# EAGLE design SC16IS750_Breakout (EAGLE 6.4)
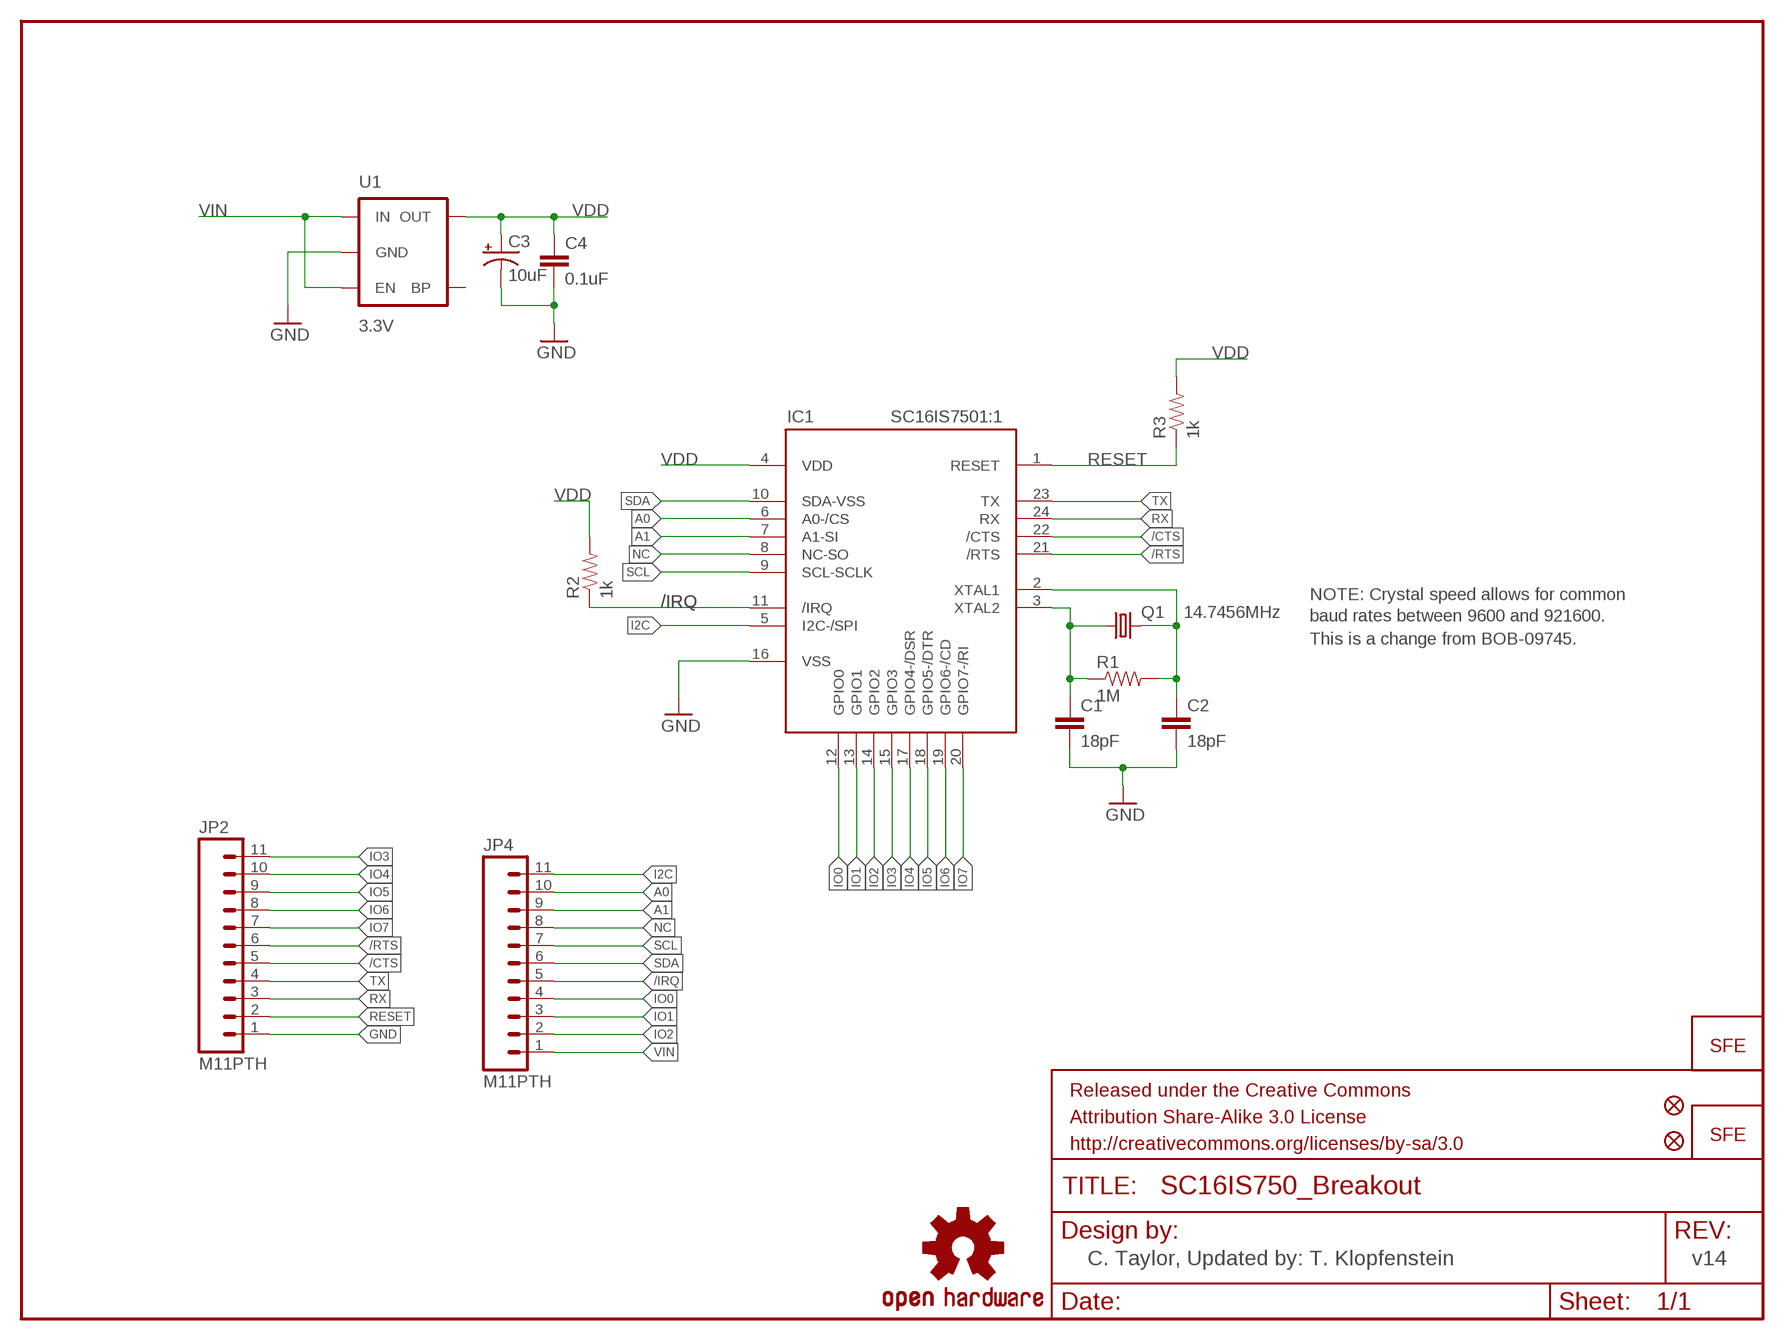
[diagram p0: schematic, sheet 1]

## Parts
C1  18pF  CAP0603-CAP  [0603-CAP]
C2  18pF  CAP0603-CAP  [0603-CAP]
C3  10uF  CAP_POL1206  [EIA3216]
C4  0.1uF  CAP0603-CAP  [0603-CAP]
IC1  SC16IS7501:1  [QFN-24_1:1]
JP1  LOGO-SFENEW  [SFE-NEW-WEBLOGO]
JP2  M11PTH  [1X11]
JP3  LOGO-SFESK  [SFE-LOGO-FLAME]
JP4  M11PTH  [1X11]
JP5  FIDUCIAL1X2  [FIDUCIAL-1X2]
JP6  FIDUCIAL1X2  [FIDUCIAL-1X2]
Q1  14.7456MHz  CRYSTAL5X3  [CRYSTAL-SMD-5X3]
R1  1M  RESISTOR0603-RES  [0603-RES]
R2  1k  RESISTOR0603-RES  [0603-RES]
R3  1k  RESISTOR0603-RES  [0603-RES]
U1  3.3V  V_REG_LDOSMD  [SOT23-5]
U$1  OSHW-LOGOS  [OSHW-LOGO-S]

## Nets
/CTS: IC1.22(/CTS) JP2.5
/IRQ: IC1.11(/IRQ) JP4.5 R2.1
/RTS: IC1.21(/RTS) JP2.6
A0: IC1.6(A0-/CS) JP4.10
A1: IC1.7(A1-SI) JP4.9
GND: C1.2 C2.2 C3.C(-) C4.2 IC1.16(VSS) JP2.1 U1.2(GND)
I2C: IC1.5(I2C-/SPI) JP4.11
IO0: IC1.12(GPIO0) JP4.4
IO1: IC1.13(GPIO1) JP4.3
IO2: IC1.14(GPIO2) JP4.2
IO3: IC1.15(GPIO3) JP2.11
IO4: IC1.17(GPIO4-/DSR) JP2.10
IO5: IC1.18(GPIO5-/DTR) JP2.9
IO6: IC1.19(GPIO6-/CD) JP2.8
IO7: IC1.20(GPIO7-/RI) JP2.7
N$23: C1.1 IC1.3(XTAL2) Q1.1 R1.1
N$24: C2.1 IC1.2(XTAL1) Q1.3 R1.2
NC: IC1.8(NC-SO) JP4.8
RESET: IC1.1(RESET) JP2.2 R3.1
RX: IC1.24(RX) JP2.3
SCL: IC1.9(SCL-SCLK) JP4.7
SDA: IC1.10(SDA-VSS) JP4.6
TX: IC1.23(TX) JP2.4
VDD: C3.A(+) C4.1 IC1.4(VDD) R2.2 R3.2 U1.5(OUT)
VIN: JP4.1 U1.1(IN) U1.3(EN)
Unconnected: U1.4(BP)

## Notes on the sheet
- NOTE: Crystal speed allows for common
- baud rates between 9600 and 921600.
- This is a change from BOB-09745.
- C. Taylor, Updated by: T. Klopfenstein | v14

## Library data of the parts
C1 C2 C4 = SparkFun-Passives:CAP: Capacitor Standard 0603 ceramic capacitor, and 0.1" leaded capacitor.
C3 = SparkFun:CAP_POL: Capacitor Polarized These are standard SMD and PTH capacitors. Normally 10uF, 47uF, and 100uF in electrolytic and tantalum varieties. Always verify the external diameter of the through hole cap, it varies with capacity, voltage, and manufacturer. The EIA devices should be standard.
IC1 = Testing:SC16IS750
JP1 JP3 = SparkFun:LOGO-SFE: Spark Fun Electronics PCB Logo This is the standard Spark Fun Electronics PCB logo.
JP2 JP4 = SparkFun:M11: Header 11 Standard 11-pin 0.1" header. Use with straight break away headers (SKU : PRT-00116), right angle break away headers (PRT-00553), swiss pins (PRT-00743), machine pins (PRT-00117), and female headers (PRT-00115).
JP5 JP6 = SparkFun:FIDUCIAL: Fiducial Alignment Points Various fiducial points for machine vision alignment.
Q1 = SparkFun:CRYSTAL: Crystals Various standard crystals. Proven footprints. Spark Fun Electronics SKU : COM-00534
R1-R3 = SparkFun-Passives:RESISTOR: Resistor Basic schematic elements and footprints for 0603, 1206, and PTH resistors.
U1 = SparkFun:V_REG_LDO: Voltage Regulator LDO Standard 150mA LDO voltage regulator in SOT-23 layout. Micrel part MIC5205. BP (by-pass) pin is used to lower output noise with 470pF cap.
U$1 = SparkFun-Aesthetics:OSHW-LOGO: Open Source Hardware Logo This logo indicates the piece of hardware it is found on incorporates a OSHW license and/or adheres to the definition of open source hardware found here: http://freedomdefined.org/OSHW

## Board
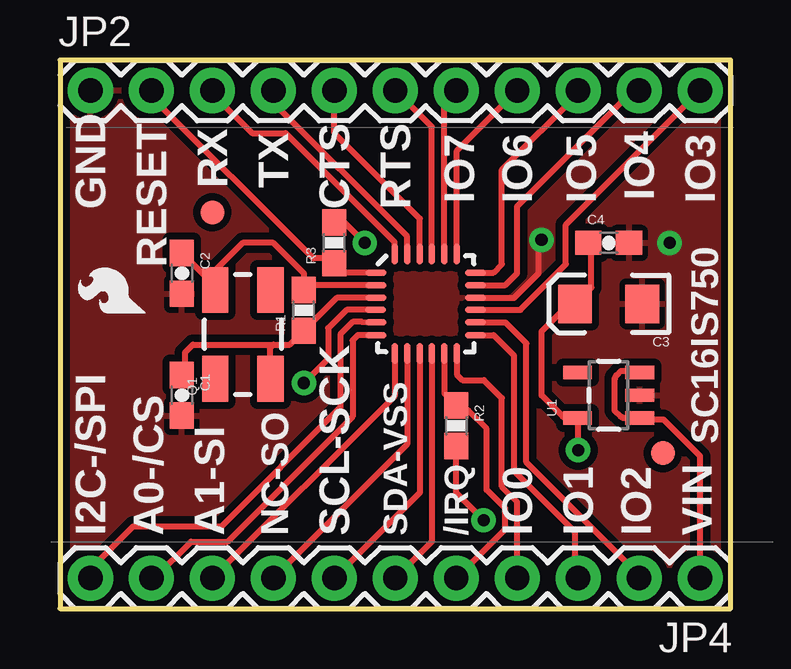
[diagram p1: board, top side]
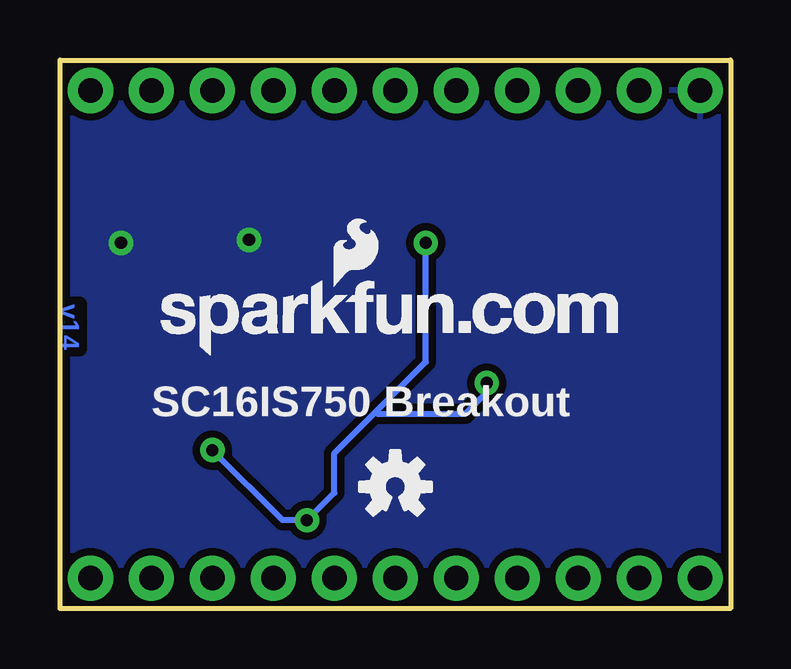
[diagram p2: board, bottom side, seen from below]

Size 27.94 x 22.86 mm. Coordinates in mm from the lower left corner, seen from the top.
Outline: 0,0 27.94,0 27.94,22.86 0,22.86 0,0
Copper layers (1*16): Top 0.035mm / dielectric 1.5mm / Bottom 0.035mm
Design rules "SparkFun *": minimum track width 8mil, minimum drill 20mil, track to track 8mil, track to pad 8mil, pad to pad 7mil, via to via 8mil, smd to smd 8mil, copper to edge 9mil, drill to drill 8mil, minimum pad ring 12mil, minimum via ring 10mil, stop-mask expansion 4mil, vias tented up to drill 20mil, thermal gap 10mil

### Footprints (pad centres in the part's own frame; a part is rotated, then mirrored left to right if it is on the bottom)
0603-CAP = smd 1.1 x 1: 1 -0.85,0; 2 0.85,0
EIA3216 = smd 1.4 x 1.6: A 1.4,0; C -1.4,0
QFN-24_1:1 = smd 0.889 x 0.279: 1 -2.076,1.301; 2 -2.076,0.775; 3 -2.076,0.25; 4 -2.102,-0.25; 5 -2.076,-0.775; 6 -2.076,-1.301; 13 2.076,-1.301; 14 2.076,-0.775; 15 2.076,-0.25; 16 2.076,0.25; 17 2.076,0.775; 18 2.076,1.301 | smd 0.279 x 0.889: 7 -1.301,-2.076; 8 -0.775,-2.076; 9 -0.25,-2.076; 10 0.25,-2.076; 11 0.775,-2.076; 12 1.301,-2.076; 19 1.301,2.076; 20 0.775,2.076; 21 0.25,2.076; 22 -0.25,2.076; 23 -0.775,2.076; 24 -1.301,2.076
1X11 = drill 1.016 pad 1.88: 1 0,0; 2 2.54,0; 3 5.08,0; 4 7.62,0; 5 10.16,0; 6 12.7,0; 7 15.24,0; 8 17.78,0; 9 20.32,0; 10 22.86,0; 11 25.4,0
FIDUCIAL-1X2 = smd 1 x 1: 1 0,0
CRYSTAL-SMD-5X3 = smd 1.9 x 1.1: 1 -1.85,-1.15; 2 1.85,-1.15; 3 1.85,1.15; 4 -1.85,1.15
0603-RES = smd 1.1 x 1: 1 -0.85,0; 2 0.85,0
SOT23-5 = smd 0.55 x 1.2: 1 -0.95,-1.3; 2 0,-1.3; 3 0.95,-1.3; 4 0.95,1.3; 5 -0.95,1.3

### Placement (x,y rotation side)
C1  5.08,8.89 270 top
C2  5.08,13.97 270 top
C3  22.86,12.7 180 top
C4  22.86,15.24 0 top
IC1  15.24,12.7 0 top
JP1  23.75,10.54 0 bottom
JP2  1.27,21.59 0 top
JP3  3.56,12.32 90 top
JP4  26.67,1.27 180 top
JP5  6.35,16.51 0 top
JP6  25.12,6.48 0 top
Q1  7.62,11.43 90 top
R1  10.16,12.43 90 top
R2  16.51,7.62 270 top
R3  11.43,15.24 90 top
U1  22.86,8.89 90 top
U$1  13.97,5.08 0 bottom
U$2  [CREATIVE_COMMONS]  0,-10.16 0 top  (outside the outline)

### Tracks (layer width: path | path; a pad name or v marks a point on that pad's centre or on a via)
/CTS
  Top 0.254: JP2.5 11.43,19.81 14.99,16.25 IC1.22
/IRQ
  Top 0.254: JP4.5 18.54,3.3 18.54,4.19 17.78,4.95 17.78,7.49 17.02,8.26 16.51,8.26 R2.1 16.02,8.96 IC1.11
/RTS
  Top 0.254: IC1.21 15.49,20.07 JP2.6
A0
  Top 0.254: JP4.10 3.94,1.27 5.46,2.79 6.99,2.79 12.19,8 12.19,11.18 12.41,11.4 IC1.6
A1
  Top 0.254: IC1.7 13.94,8.86 JP4.9
GND  (via drill 0.51)
  Top 0.254: IC1.16 18.92,12.95 19.94,13.97 19.94,15.24 v20.07,15.37
  other vias: 25.4,15.24
  pour Top (isolate 0.305): 0,22.86 0,0 27.94,0 27.94,22.86
  pour Bottom (isolate 0.305): 0,22.86 0,0 27.94,0 27.94,22.86
I2C
  Top 0.254: JP4.11 1.27,1.65 3.05,3.43 6.73,3.43 11.68,8.38 11.68,11.43 12.2,11.95 12.59,11.95 IC1.5
IO0
  Top 0.254: 19.18,1.27 JP4.4 19.05,4.45 18.41,5.08 18.41,8.78 17.66,9.53 16.76,9.53 16.54,9.75 IC1.12
IO1
  Top 0.254: JP4.3 21.46,1.14 21.46,3.17 18.92,5.71 18.92,10.54 18.07,11.4 IC1.13
IO2
  Top 0.254: JP4.2 24.13,1.4 19.43,6.1 19.43,11.05 18.55,11.93 IC1.14
IO3
  Top 0.254: IC1.15 19.18,12.45 21.08,14.35 21.08,16 JP2.11
IO4
  Top 0.254: JP2.10 23.88,21.59 19.05,16.76 19.05,13.97 18.55,13.47 IC1.17
IO5
  Top 0.254: JP2.9 21.59,21.46 18.41,18.29 18.41,14.35 18.07,14 IC1.18
IO6
  Top 0.254: 19.18,21.59 JP2.8 16.54,19.08 IC1.19
IO7
  Top 0.254: IC1.20 16.02,21.09 JP2.7
N$23
  Top 0.254: 8.77,9.64 8.76,9.65 | Q1.1 8.77,9.64 | R1.1 10.16,11.83 10.22,11.89 | 5,10 5,9.82 C1.1 5.21,9.87 5.21,10.67 5.54,11 8.89,11 | 8.89,11 9.58,11 R1.1 | 8.77,9.64 8.77,10.88 8.89,11 | IC1.3 11.53,12.95 R1.1
N$24
  Top 0.254: 6.48,12.7 6.48,13.21 6.47,13.21 Q1.3 6.47,13.43 6.14,13.76 | R1.2 10.16,13.16 10,13 | 10.33,13.45 R1.2 | 6.14,13.76 C2.1 | 6.14,13.76 7.62,15.24 8.89,15.24 10.16,13.97 R1.2 | IC1.2 10.36,13.47 R1.2
NC
  Top 0.254: 9.02,1.27 JP4.8 14.46,6.84 IC1.8
RESET
  Top 0.254: JP2.2 3.68,21.46 10.56,14.59 11.45,14.59 R3.1 11.82,14 IC1.1
RX
  Top 0.254: JP2.3 6.35,21.46 8,19.81 9.4,19.81 13.94,15.27 IC1.24
SCL
  Top 0.254: IC1.9 14.99,4.83 JP4.7
SDA
  Top 0.254: IC1.10 15.49,2.79 JP4.6
TX
  Top 0.254: JP2.4 8.89,21.08 14.46,15.51 IC1.23
VDD  (via drill 0.51)
  Top 0.254: v21.59,6.6 21.59,7.87 21.56,7.9 U1.5 21.12,7.94 arc-45 20.94,8.01 20.07,8.89 20.07,11.56 21.34,12.83 C3.A arc-44 C3.A 22.14,13.37 22.14,15.11 C4.1 | v10.16,9.4 11.18,10.41 11.18,11.68 11.94,12.45 IC1.4 | R2.2 16.51,4.83 v17.65,3.68 | R3.2 11.85,16.09 v12.7,15.24
  Bottom 0.254: v12.7,15.24 12.7,10.29 14.8,8.19 | v10.16,9.4 10.16,9.02 11.05,8.13 14.73,8.13 14.8,8.19 | v21.59,6.6 18.67,3.68 v17.65,3.68 16.51,4.83 16.51,6.48 14.8,8.19
VIN
  Top 0.254: U1.3 arc45 24.21,9.86 24.26,9.91 23.37,9.91 23.19,9.73 arc45 23.11,9.55 23.11,8.26 23.36,8.01 arc45 23.53,7.94 U1.1 arc-45 24.14,7.88 24.13,7.87 25.15,7.87 26.67,6.35 JP4.1

### Text on the board
Bottom: v14
tPlace: RX | TX | GND | CTS | RTS | IO7 | IO6 | IO5 | IO4 | IO3 | RESET | SC16IS750 | I2C-/SPI | A0-/CS | A1-SI | NC-SO | SCL-SCK | SDA-VSS | /IRQ | IO0 | IO1 | IO2 | VIN
bPlace: SC16IS750 Breakout
tValues: C. Taylor, Updated by: T. Klopfenstein